# EAGLE design polarization_switch_mid (EAGLE 9.6.2)
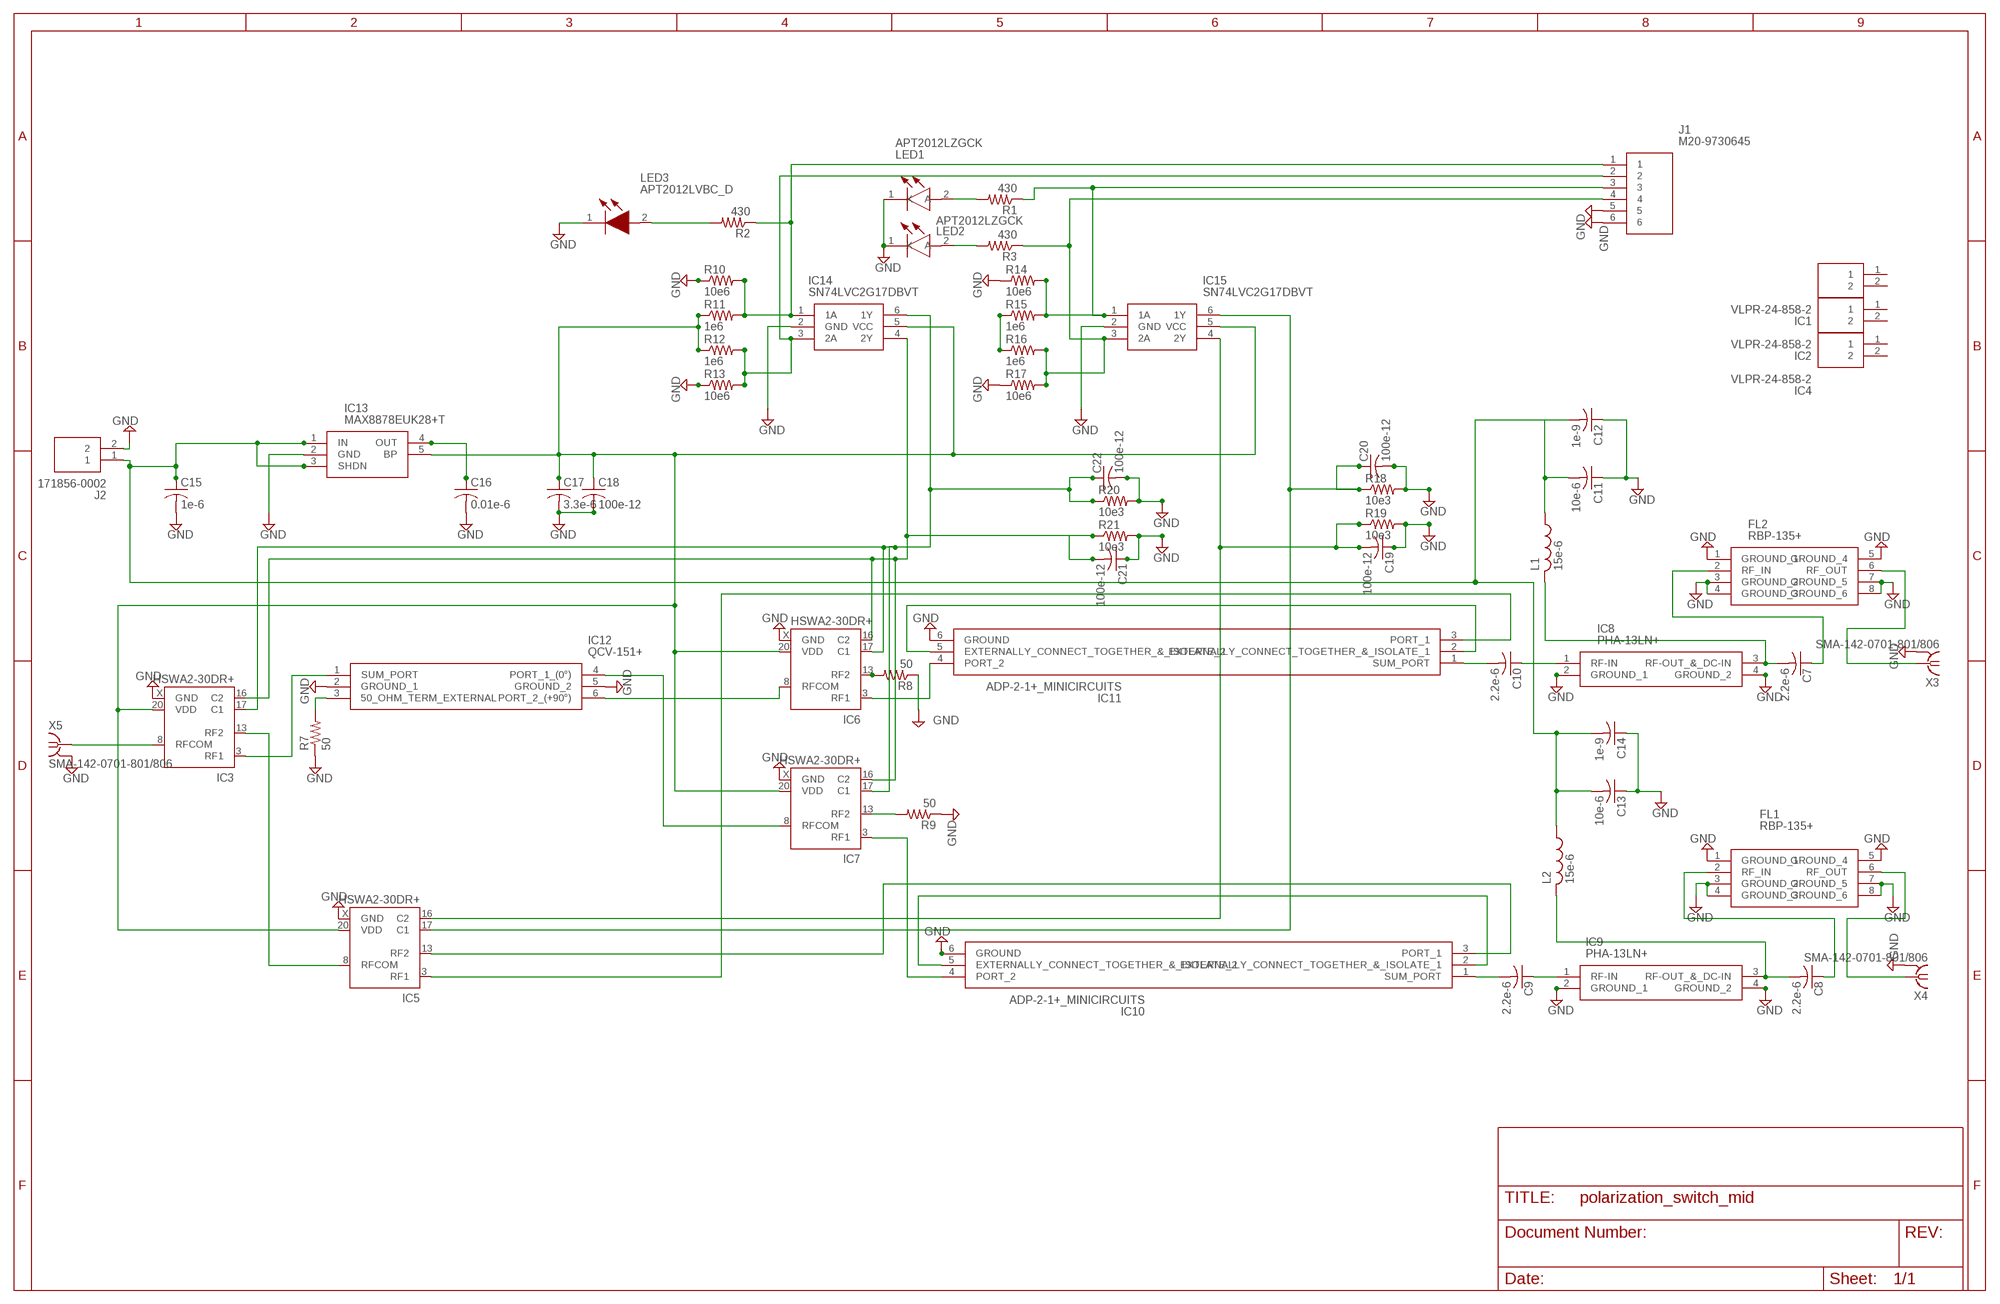
[diagram p0: schematic, sheet 1]

## Parts
C7  2.2e-6  C-USC0603  [C0603]
C8  2.2e-6  C-USC0603  [C0603]
C9  2.2e-6  C-USC0603  [C0603]
C10  2.2e-6  C-USC0603  [C0603]
C11  10e-6  C-USC0603  [C0603]
C12  1e-9  C-USC0603  [C0603]
C13  10e-6  C-USC0603  [C0603]
C14  1e-9  C-USC0603  [C0603]
C15  1e-6  C-USC0603  [C0603]
C16  0.01e-6  C-USC0603  [C0603]
C17  3.3e-6  C-USC0603  [C0603]
C18  100e-12  C-USC0603  [C0603]
C19  100e-12  C-USC0603  [C0603]
C20  100e-12  C-USC0603  [C0603]
C21  100e-12  C-USC0603  [C0603]
C22  100e-12  C-USC0603  [C0603]
FL1  RBP-135+  [RBP135]
FL2  RBP-135+  [RBP135]
IC1  VLPR-24-858-2  [VLPR248582]
IC2  VLPR-24-858-2  [VLPR248582]
IC3  HSWA2-30DR+  [DG983-1]
IC4  VLPR-24-858-2  [VLPR248582]
IC5  HSWA2-30DR+  [DG983-1]
IC6  HSWA2-30DR+  [DG983-1]
IC7  HSWA2-30DR+  [DG983-1]
IC8  PHA-13LN+  [PHA13LN]
IC9  PHA-13LN+  [PHA13LN]
IC10  ADP-2-1+_MINICIRCUITS  [SOTFL254P691X411-6N]
IC11  ADP-2-1+_MINICIRCUITS  [SOTFL254P691X411-6N]
IC12  QCV-151+  [QCV151]
IC13  MAX8878EUK28+T  [SOT95P280X145-5N]
IC14  SN74LVC2G17DBVT  [SOT95P280X145-6N]
IC15  SN74LVC2G17DBVT  [SOT95P280X145-6N]
J1  M20-9730645  [HDRV6W66P0X254_1X6_1524X254X96]
J2  171856-0002  [SHDR2W90P0X254_1X2_493X635X106]
L1  15e-6  L-USL3225M  [L3225M]
L2  15e-6  L-USL3225M  [L3225M]
LED1  APT2012LZGCK  [LEDC2012X85N]
LED2  APT2012LZGCK  [LEDC2012X85N]
LED3  APT2012LVBC_D  [LEDC2012X85N]
R1  430  R-US_R0603  [R0603]
R2  430  R-US_R0603  [R0603]
R3  430  R-US_R0603  [R0603]
R7  50  R-US_R0603  [R0603]
R8  50  R-US_R0603  [R0603]
R9  50  R-US_R0603  [R0603]
R10  10e6  R-US_R0603  [R0603]
R11  1e6  R-US_R0603  [R0603]
R12  1e6  R-US_R0603  [R0603]
R13  10e6  R-US_R0603  [R0603]
R14  10e6  R-US_R0603  [R0603]
R15  1e6  R-US_R0603  [R0603]
R16  1e6  R-US_R0603  [R0603]
R17  10e6  R-US_R0603  [R0603]
R18  10e3  R-US_R0603  [R0603]
R19  10e3  R-US_R0603  [R0603]
R20  10e3  R-US_R0603  [R0603]
R21  10e3  R-US_R0603  [R0603]
X3  SMA-142-0701-801/806  [J502-ND-142-0701-801/806]
X4  SMA-142-0701-801/806  [J502-ND-142-0701-801/806]
X5  SMA-142-0701-801/806  [J502-ND-142-0701-801/806]

## Nets
GND: C11.1 C12.1 C13.1 C14.1 C15.2 C16.2 C17.2 C18.2 C19.1 C20.2 C21.1 C22.2 FL1.1(GROUND_1) FL1.3(GROUND_2) FL1.4(GROUND_3) FL1.5(GROUND_4) FL1.7(GROUND_5) FL1.8(GROUND_6) FL2.1(GROUND_1) FL2.3(GROUND_2) FL2.4(GROUND_3) FL2.5(GROUND_4) FL2.7(GROUND_5) FL2.8(GROUND_6) IC3.X(GND) IC5.X(GND) IC6.X(GND) IC7.X(GND) IC8.2(GROUND_1) IC8.4(GROUND_2) IC9.2(GROUND_1) IC9.4(GROUND_2) IC10.6(GROUND) IC11.6(GROUND) IC12.2(GROUND_1) IC12.5(GROUND_2) IC13.2(GND) IC14.2(GND) IC15.2(GND) J1.5 J1.6 J2.2 LED1.1(K) LED2.1(K) LED3.1(K) R7.1 R8.1 R9.1 R10.1 R13.1 R14.1 R17.1 R18.2 R19.2 R20.2 R21.2 X3.G@1 X3.G@2 X3.G@3 X3.G@4 X4.G@1 X4.G@2 X4.G@3 X4.G@4 X5.G@1 X5.G@2 X5.G@3 X5.G@4
N$1: LED2.2(A) R3.2
N$2: LED1.2(A) R1.2
N$3: LED3.2(A) R2.2
N$4: IC5.13(RF2) IC10.3(PORT_1)
N$5: IC3.8(RFCOM) X5.1
N$6: C10.2 IC11.1(SUM_PORT)
N$7: IC7.3(RF1) IC10.4(PORT_2)
N$8: C20.1 IC5.17(C1) IC15.6(1Y) R18.1
N$9: IC7.8(RFCOM) IC12.4(PORT_1_(0°))
N$13: C10.1 IC8.1(RF-IN)
N$14: IC3.3(RF1) IC12.1(SUM_PORT)
N$15: IC3.13(RF2) IC5.8(RFCOM)
N$16: IC6.8(RFCOM) IC12.6(PORT_2_(+90°))
N$18: IC6.3(RF1) IC11.4(PORT_2)
N$19: IC6.13(RF2) R8.2
N$20: C7.2 IC8.3(RF-OUT_&_DC-IN) L1.2
N$21: C9.2 IC10.1(SUM_PORT)
N$22: IC11.2(EXTERNALLY_CONNECT_TOGETHER_&_ISOLATE_1) IC11.5(EXTERNALLY_CONNECT_TOGETHER_&_ISOLATE_2)
N$23: IC5.3(RF1) IC11.3(PORT_1)
N$25: IC10.2(EXTERNALLY_CONNECT_TOGETHER_&_ISOLATE_1) IC10.5(EXTERNALLY_CONNECT_TOGETHER_&_ISOLATE_2)
N$26: C9.1 IC9.1(RF-IN)
N$27: C8.2 IC9.3(RF-OUT_&_DC-IN) L2.2
N$28: C7.1 FL2.2(RF_IN)
N$29: FL2.6(RF_OUT) X3.1
N$30: C8.1 FL1.2(RF_IN)
N$31: FL1.6(RF_OUT) X4.1
N$32: IC12.3(50_OHM_TERM_EXTERNAL) R7.2
N$35: IC7.13(RF2) R9.2
N$36: C11.2 C12.2 C13.2 C14.2 C15.1 IC13.1(IN) IC13.3(SHDN) J2.1 L1.1 L2.1
N$37: IC14.1(1A) J1.1 R2.1 R10.2 R11.2
N$38: C19.2 IC5.16(C2) IC15.4(2Y) R19.1
N$39: C17.1 C18.1 IC3.20(VDD) IC5.20(VDD) IC6.20(VDD) IC7.20(VDD) IC13.5(BP) IC14.5(VCC) IC15.5(VCC) R11.1 R12.1
N$40: C16.1 IC13.4(OUT)
N$42: C22.1 IC3.17(C1) IC6.17(C1) IC7.17(C1) IC14.6(1Y) R20.1
N$43: IC14.3(2A) J1.2 R12.2 R13.2
N$44: IC15.1(1A) J1.3 R1.1 R14.2 R15.2
N$45: IC15.3(2A) J1.4 R3.1 R16.2 R17.2
N$46: C21.2 IC3.16(C2) IC6.16(C2) IC7.16(C2) IC14.4(2Y) R21.1
N$48: R15.1 R16.1
Unconnected: IC1.1 IC1.2 IC2.1 IC2.2 IC4.1 IC4.2

## Power pins joined to a net without a drawn wire
GND: IC3.1(GND) IC3.2(GND) IC3.4(GND) IC3.5(GND) IC3.6(GND) IC3.7(GND) IC3.9(GND) IC3.10(GND) IC3.11(GND) IC3.12(GND) IC3.14(GND) IC3.15(GND) IC3.18(GND) IC3.19(GND) IC5.1(GND) IC5.2(GND) IC5.4(GND) IC5.5(GND) IC5.6(GND) IC5.7(GND) IC5.9(GND) IC5.10(GND) IC5.11(GND) IC5.12(GND) IC5.14(GND) IC5.15(GND) IC5.18(GND) IC5.19(GND) IC6.1(GND) IC6.2(GND) IC6.4(GND) IC6.5(GND) IC6.6(GND) IC6.7(GND) IC6.9(GND) IC6.10(GND) IC6.11(GND) IC6.12(GND) IC6.14(GND) IC6.15(GND) IC6.18(GND) IC6.19(GND) IC7.1(GND) IC7.2(GND) IC7.4(GND) IC7.5(GND) IC7.6(GND) IC7.7(GND) IC7.9(GND) IC7.10(GND) IC7.11(GND) IC7.12(GND) IC7.14(GND) IC7.15(GND) IC7.18(GND) IC7.19(GND)

## Library data of the parts
C7-C22 = rcl:C-US: CAPACITOR, American symbol; SPICEPREFIX: C
FL1 FL2 = RBP-135+:RBP-135+: Metal Shield Bandpass Filter Source: Datasheet <https://www.minicircuits.com/pdfs/RBP-135 .pdf>; DESCRIPTION: Metal Shield Bandpass Filter; HEIGHT: 2.54mm; MANUFACTURER_NAME: Mini-Circuits; MANUFACTURER_PART_NUMBER: RBP-135+
IC1 IC2 IC4 = VLPR-24-858-2:VLPR-24-858-2: LED Light Pipes Light Pipe Vert SMD Rect Face Source: Datasheet <http://uk.rs-online.com/web/p/products/9063748>; DESCRIPTION: LED Light Pipes Light Pipe Vert SMD Rect Face; HEIGHT: 21mm; MANUFACTURER_NAME: Bivar; MANUFACTURER_PART_NUMBER: VLPR-24-858-2; RS_PART_NUMBER: 9063748; RS_PRICE-STOCK: http://uk.rs-online.com/web/p/products/9063748
IC3 IC5-IC7 = minicircuits:HSWA2-30DR+: SPDT RF SWITCH Absorptive RF Switch with internal driver Source: http://www.minicircuits.com .. HSWA2-30DR+.pdf; OC_FARNELL: unknown; OC_NEWARK: unknown
IC8 IC9 = PHA-13LN+:PHA-13LN+: ic Source: Datasheet <https://www.minicircuits.com/pdfs/PHA-13LN .pdf>; DESCRIPTION: ic; HEIGHT: 1.6mm; MANUFACTURER_NAME: Mini Circuits; MANUFACTURER_PART_NUMBER: PHA-13LN+
IC10 IC11 = ADP-2-1+_MINICIRCUITS:ADP-2-1+_MINICIRCUITS: Power Splitter/Combiner Source: Datasheet <https://www.minicircuits.com/pdfs/ADP-2-1 .pdf>; DESCRIPTION: Power Splitter/Combiner; HEIGHT: 4.11mm; MANUFACTURER_NAME: Mini-Circuits; MANUFACTURER_PART_NUMBER: ADP-2-1+ MINICIRCUITS
IC12 = QCV-151+:QCV-151+: 2 Way-90 Power Splitter Source: Datasheet <https://www.minicircuits.com/pdfs/QCV-151 .pdf>; DESCRIPTION: 2 Way-90 Power Splitter; HEIGHT: 1.652mm; MANUFACTURER_NAME: Mini-Circuits; MANUFACTURER_PART_NUMBER: QCV-151+
IC13 = MAX8878EUK28+T:MAX8878EUK28+T: LDO Voltage Regulators Low-Noise, Low-Dropout, 150mA Linear Regulators with 2982 Pinout Source: Datasheet <https://www.mouser.com/datasheet/2/256/MAX8878-1389229.pdf>; DESCRIPTION: LDO Voltage Regulators Low-Noise, Low-Dropout, 150mA Linear Regulators with 2982 Pinout; HEIGHT: 1.45mm; MANUFACTURER_NAME: Maxim Integrated; MANUFACTURER_PART_NUMBER: MAX8878EUK28+T
IC14 IC15 = SN74LVC2G17DBVT:SN74LVC2G17DBVT: DUAL SCHMITT-TRIGGER BUFFER Source: Datasheet <http://www.ti.com/lit/gpn/SN74LVC2G17>; DESCRIPTION: DUAL SCHMITT-TRIGGER BUFFER; HEIGHT: 1.45mm; MANUFACTURER_NAME: Texas Instruments; MANUFACTURER_PART_NUMBER: SN74LVC2G17DBVT; MOUSER_PART_NUMBER: 595-SN74LVC2G17DBVT; MOUSER_PRICE-STOCK: https://www.mouser.com/Search/Refine.aspx?Keyword=595-SN74LVC2G17DBVT; RS_PART_NUMBER: 6628944P; RS_PRICE-STOCK: http://uk.rs-online.com/web/p/products/6628944P
J1 = M20-9730645:M20-9730645: Headers & Wire Housings 06 SIL VERTICAL PIN HEADER GOLD HT Source: Datasheet <https://cdn.harwin.com/pdfs/C001XX_M20_Series_Connectors.pdf>; DESCRIPTION: Headers & Wire Housings 06 SIL VERTICAL PIN HEADER GOLD HT; HEIGHT: 9.64mm; MANUFACTURER_NAME: HARWIN; MANUFACTURER_PART_NUMBER: M20-9730645; MOUSER_PART_NUMBER: 855-M20-9730645; MOUSER_PRICE-STOCK: https://www.mouser.com/Search/Refine.aspx?Keyword=855-M20-9730645
J2 = 171856-0002:171856-0002: KK 254 RPC Pin Header friction lock 2way Molex KK 254 Series, Series Number 171856, 2.54mm Pitch 2 Way 1 Row Straight PCB Header, Through Hole Source: Datasheet <https://www.digikey.com/product-detail/en/molex/1718560002/WM10153-ND/4423109>; ALLIED_NUMBER: 70314268; ALLIED_PRICE-STOCK: https://www.alliedelec.com/molexincorporated-171856-0002/70314268/; DESCRIPTION: KK 254 RPC Pin Header friction lock 2way Molex KK 254 Series, Series Number 171856, 2.54mm Pitch 2 Way 1 Row Straight PCB Header, Through Hole; HEIGHT: 10.61mm; MANUFACTURER_NAME: Molex; MANUFACTURER_PART_NUMBER: 171856-0002; MOUSER_PART_NUMBER: 538-171856-0002; MOUSER_PRICE-STOCK: https://www.mouser.com/Search/Refine.aspx?Keyword=538-171856-0002; RS_PART_NUMBER: 7922884P; RS_PRICE-STOCK: http://uk.rs-online.com/web/p/products/7922884P
L1 L2 = rcl:L-US: INDUCTOR, American symbol; SPICEPREFIX: L
LED1 LED2 = APT2012LZGCK:APT2012LZGCK: Standard LEDs - SMD 2.0X1.2MM LOW CRNT Source: Datasheet <http://www.kingbrightusa.com/images/catalog/SPEC/APT2012LZGCK.pdf>; ALLIED_NUMBER: 71056205; ALLIED_PRICE-STOCK: https://www.alliedelec.com/kingbright-apt2012lzgck/71056205/; DESCRIPTION: Standard LEDs - SMD 2.0X1.2MM LOW CRNT; HEIGHT: 0.85mm; MANUFACTURER_NAME: Kingbright; MANUFACTURER_PART_NUMBER: APT2012LZGCK; MOUSER_PART_NUMBER: 604-APT2012LZGCK; MOUSER_PRICE-STOCK: https://www.mouser.com/Search/Refine.aspx?Keyword=604-APT2012LZGCK
LED3 = APT2012LVBC_D:APT2012LVBC_D: Standard LEDs - SMD 2.0X1.2MM LOW CRNT Source: Datasheet <https://componentsearchengine.com/Datasheets/1/APT2012LVBC_D.pdf>; ARROW_PART_NUMBER: APT2012LVBC/D; ARROW_PRICE-STOCK: https://www.arrow.com/en/products/apt2012lvbcd/kingbright; DESCRIPTION: Standard LEDs - SMD 2.0X1.2MM LOW CRNT; HEIGHT: 0.85mm; MANUFACTURER_NAME: Kingbright; MANUFACTURER_PART_NUMBER: APT2012LVBC/D; MOUSER_PART_NUMBER: 604-APT2012LVBCD; MOUSER_PRICE-STOCK: https://www.mouser.co.uk/ProductDetail/Kingbright/APT2012LVBC-D?qs=6oMev5NRZMGErJYT6KZLXg%3D%3D
R1-R3 R7-R21 = rcl:R-US_: RESISTOR, American symbol; SPICEPREFIX: R
X3-X5 = sma-flange_375mils:SMA-: SMA 50 Ohm End Launch Jack Receptacle - Round Contact Johnson Components Source: www.johnsoncomponents.com .. J502-ND.pdf; MF: JOHNSON COMPONENTS; MPN: 142-0701-801; OC_FARNELL: 1608592; OC_NEWARK: 90F2624

## Board
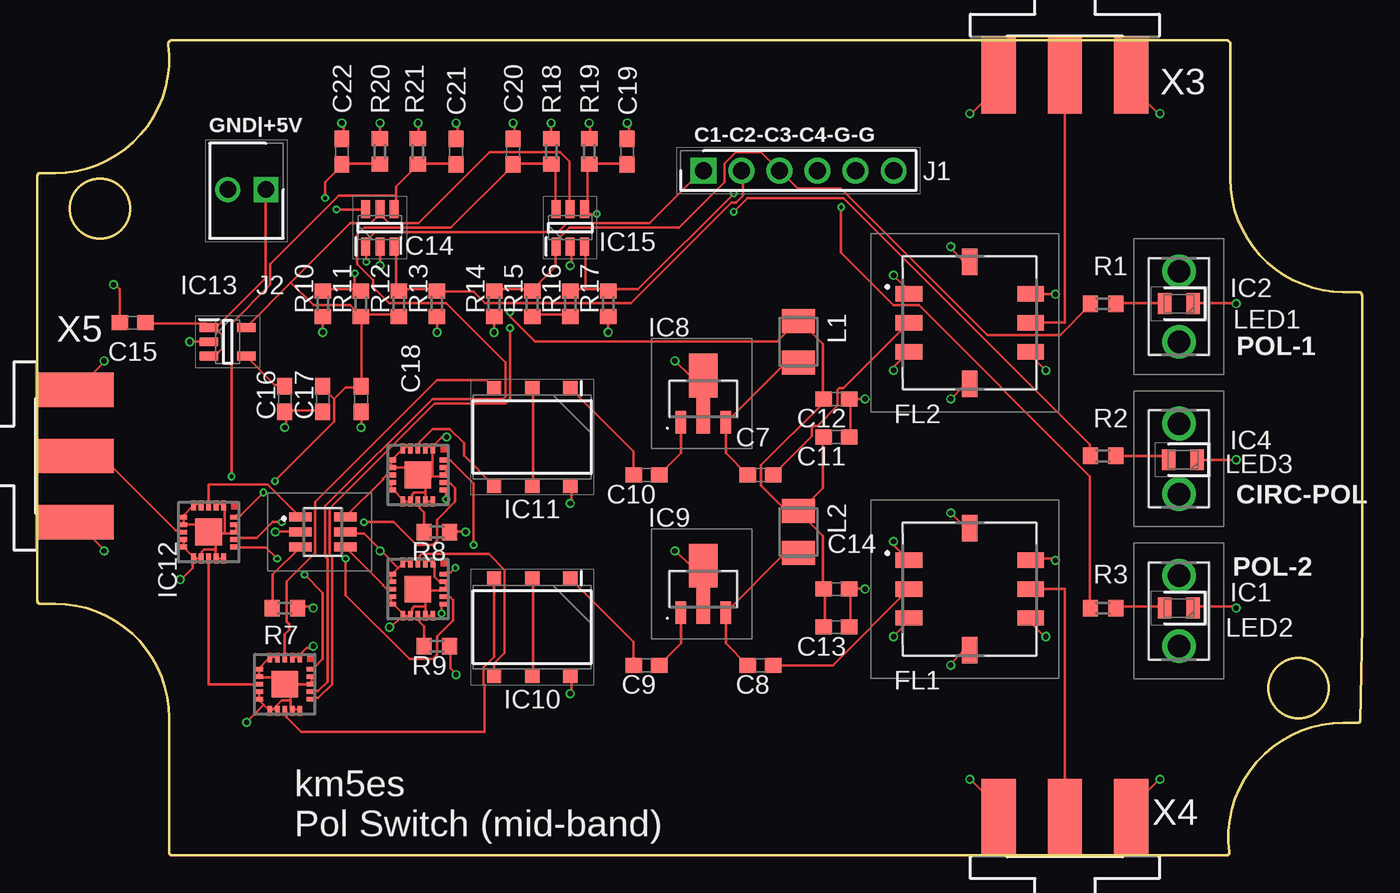
[diagram p1: board, top side]
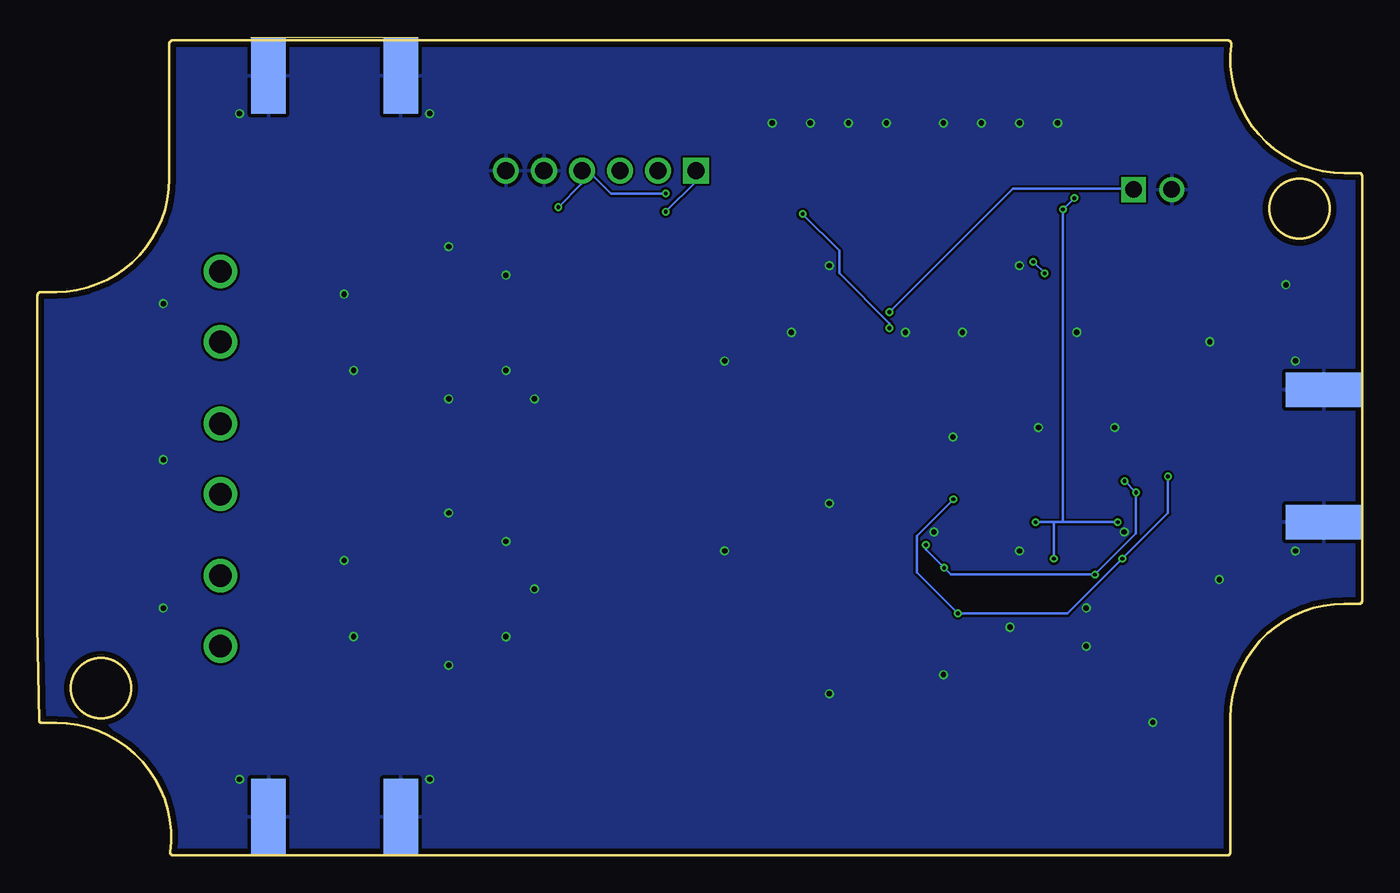
[diagram p2: board, bottom side, seen from below]

Size 88.42 x 54.42 mm. Coordinates in mm from the lower left corner, seen from the top.
Outline: 1.18,45.55 0.18,45.55 arc90 0,45.38 0,16.98 arc90 0.18,16.8 1.18,16.8 arc-90 8.8,9.18 8.8,0.18 arc90 8.98,0 79.38,0 arc97 79.55,0.2 arc-97 87.18,8.86 88.18,8.86 arc89 88.29,8.97 88.42,15.34 88.42,37.38 arc90 88.18,37.62 87.18,37.62 arc-90 79.62,45.18 79.62,54.18 arc90 79.38,54.42 8.98,54.42 arc99 8.74,54.14 arc-97 1.18,45.55
Outline: circle at 84.18,11.18 radius 2
Outline: circle at 4.18,43.18 radius 2
Copper layers (1*16): Top 0.035559375mm / dielectric 1.6mm / Bottom 0.035559375mm
Design rules "oshpark-2layer": minimum track width 6mil, minimum drill 10mil, track to track 6mil, track to pad 6mil, pad to pad 6mil, via to via 6mil, smd to smd 6mil, copper to edge 15mil, drill to drill 6mil, minimum pad ring 5mil, minimum via ring 5mil, stop-mask expansion 2.5mil, vias tented up to drill 0mil, thermal gap 10mil

### Footprints (pad centres in the part's own frame; a part is rotated, then mirrored left to right if it is on the bottom)
C0603 = smd 1.1 x 1: 1 -0.85,0; 2 0.85,0
RBP135 = smd 1.02 x 1.78: 1 -1.93,-4.065; 2 0,-4.065; 3 1.93,-4.065; 5 1.93,4.065; 6 0,4.065; 7 -1.93,4.065 | smd 1.78 x 1.02: 4 4.065,0; 8 -4.065,0
VLPR248582 = drill 1.5 pad 2.25: 1 0,0; 2 0,4.7
DG983-1 = smd 0.66 x 0.31: 1 -1.775,1; 2 -1.775,0.5; 3 -1.775,0; 4 -1.775,-0.5; 5 -1.775,-1; 11 1.775,-1; 12 1.775,-0.5; 13 1.775,0; 14 1.775,0.5; 15 1.775,1 | smd 0.31 x 0.66: 6 -1,-1.775; 7 -0.5,-1.775; 8 0,-1.775; 9 0.5,-1.775; 10 1,-1.775; 16 1,1.775; 17 0.5,1.775; 18 0,1.775; 19 -0.5,1.775; 20 -1,1.775 | smd 1.78 x 1.78: X 0,0
PHA13LN = smd 0.71 x 1.5: 1 -1.5,-1.56; 3 1.5,-1.56 | smd 0.91 x 2.5: 2 0,-1.06 | smd 1.91 x 2.92: 4 0,1.56
SOTFL254P691X411-6N = smd 0.935 x 0.96: 1 -3.262,2.54; 2 -3.262,0; 3 -3.262,-2.54; 4 3.262,-2.54; 5 3.262,0; 6 3.262,2.54
QCV151 = smd 0.6 x 1.5: 1 1,1.5; 2 0,1.5; 3 -1,1.5; 4 -1,-1.5; 5 0,-1.5; 6 1,-1.5
SOT95P280X145-5N = smd 1.25 x 0.6: 1 -1.25,0.95; 2 -1.25,0; 3 -1.25,-0.95; 4 1.25,-0.95; 5 1.25,0.95
SOT95P280X145-6N = smd 1.2 x 0.6: 1 -1.25,0.95; 2 -1.25,0; 3 -1.25,-0.95; 4 1.25,-0.95; 5 1.25,0; 6 1.25,0.95
HDRV6W66P0X254_1X6_1524X254X96 = drill 1.15 pad 1.725 square: 1 0,0 | drill 1.15 pad 1.725: 2 2.54,0; 3 5.08,0; 4 7.62,0; 5 10.16,0; 6 12.7,0
SHDR2W90P0X254_1X2_493X635X106 = drill 1.1 pad 1.65 square: 1 0,0 | drill 1.1 pad 1.65: 2 2.54,0
L3225M = smd 1.6 x 2.2: 1 -1.4,0; 2 1.4,0
LEDC2012X85N = smd 0.9 x 1.4: 1 -0.95,0; 2 0.95,0
R0603 = smd 1 x 1.1: 1 -0.85,0; 2 0.85,0
J502-ND-142-0701-801/806 = smd 5.08 x 2.286: 1 2.565,0; G@1 2.565,4.42; G@2 2.565,-4.42 | smd 5.08 x 2.286 bottom: G@3 2.565,4.42; G@4 2.565,-4.42

### Placement (x,y rotation side)
C7  48.26,25.4 180 top
C8  48.26,12.7 180 top
C9  40.64,12.7 180 top
C10  40.64,25.4 180 top
C11  53.34,27.94 180 top
C12  53.34,30.48 180 top
C13  53.34,15.24 180 top
C14  53.34,17.78 180 top
C15  6.35,35.56 180 top
C16  16.51,30.48 270 top
C17  19.05,30.48 270 top
C18  21.59,30.48 270 top
C19  39.37,46.99 270 top
C20  31.75,46.99 90 top
C21  27.94,46.99 270 top
C22  20.32,46.99 90 top
FL1  62.23,17.78 270 top
FL2  62.23,35.56 270 top
IC1  76.2,13.97 0 top
IC2  76.2,34.29 0 top
IC3  11.43,21.59 270 top
IC4  76.2,24.13 0 top
IC5  16.51,11.43 270 top
IC6  25.4,25.4 270 top
IC7  25.4,17.78 270 top
IC8  44.45,30.48 0 top
IC9  44.45,17.78 0 top
IC10  33.02,15.24 270 top
IC11  33.02,27.94 270 top
IC12  19.05,21.59 90 top
IC13  12.7,34.29 0 top
IC14  22.86,41.91 90 top
IC15  35.56,41.91 90 top
J1  44.45,45.72 0 top
J2  15.24,44.45 180 top
L1  50.8,34.29 270 top
L2  50.8,21.59 270 top
LED1  76.2,36.83 180 top
LED2  76.2,16.51 180 top
LED3  76.45,26.42 180 top
R1  71.12,36.83 0 top
R2  71.12,26.67 0 top
R3  71.12,16.51 0 top
R7  16.51,16.51 180 top
R8  26.67,21.59 180 top
R9  26.67,13.97 180 top
R10  19.05,36.83 90 top
R11  21.59,36.83 90 top
R12  24.13,36.83 90 top
R13  26.67,36.83 90 top
R14  30.48,36.83 90 top
R15  33.02,36.83 90 top
R16  35.56,36.83 90 top
R17  38.1,36.83 90 top
R18  34.29,46.99 90 top
R19  36.83,46.99 90 top
R20  22.86,46.99 90 top
R21  25.4,46.99 90 top
X3  68.58,54.61 270 top
X4  68.58,0 90 top
X5  0,26.67 0 top

### Tracks (layer width: path | path; a pad name or v marks a point on that pad's centre or on a via)
GND  (via drill 0.35)
  Top 0.152: IC8.2 44.5,29.57 44.5,32 IC8.4 44.35,32.16 43.43,32.16 42.67,32.92 v42.55,33.02 | IC9.2 44.5,16.76 44.5,19.2 IC9.4 44.35,19.36 43.59,19.36 42.67,20.27 v42.55,20.32 | IC6.4 24.84,27.28 24.54,27.28 IC6.5 24.38,27.13 23.77,26.52 IC6.6 23.62,26.36 IC6.7 23.77,25.91 24.84,25.91 25.3,25.45 IC6.X | IC6.9 23.62,24.84 23.62,24.54 IC6.10 23.77,24.38 24.38,23.77 IC6.11 24.54,23.62 24.84,23.62 IC6.12 24.99,23.77 24.99,24.08 25.15,24.23 25.91,24.23 | IC6.19 27.28,25.76 27.28,25.45 IC6.18 27.13,25.3 26.36,25.3 | IC6.15 26.36,23.62 IC6.14 25.91,23.77 25.91,24.23 | 25.91,24.84 25.91,24.23 | 25.91,24.84 25.45,25.3 IC6.X | 25.91,24.84 26.36,25.3 | 25.91,24.84 IC6.X | IC5.4 16,13.26 15.54,13.26 IC5.5 15.39,13.11 14.78,12.5 IC5.6 14.78,12.34 14.78,12.04 IC5.7 14.78,11.89 16,11.89 16.46,11.43 IC5.X | IC5.19 18.29,11.89 IC5.18 17.22,11.43 16.92,11.12 | IC5.15 17.37,9.75 17.07,9.75 IC5.14 16.92,9.75 16.92,10.36 | 16.92,11.12 16.92,10.36 | 16.92,11.12 16.61,11.43 IC5.X | 16.92,11.12 IC5.X | 9.75,22.1 9.75,22.55 IC3.6 9.75,22.71 10.36,23.32 IC3.5 10.52,23.47 10.82,23.47 IC3.4 | IC3.11 10.52,19.81 10.82,19.81 IC3.12 10.97,19.96 10.97,20.27 11.12,20.42 11.89,20.42 | IC3.9 9.75,21.03 9.75,20.73 IC3.10 9.75,20.57 10.36,19.96 IC3.11 | IC3.2 12.04,23.47 12.34,23.47 IC3.1 12.5,23.32 12.5,21.49 | IC3.19 13.26,21.95 13.26,21.64 IC3.18 13.11,21.49 12.5,21.49 | IC3.15 12.34,19.81 12.04,19.81 IC3.14 11.89,19.96 11.89,20.42 | 11.89,21.03 11.89,20.42 | 11.89,21.03 11.43,21.49 IC3.X | 12.5,21.49 12.34,21.49 11.89,21.03 | 11.89,21.03 IC3.X | 9.75,22.1 10.97,22.1 11.43,21.64 IC3.X | 9.75,22.1 IC3.7
  Top 0.152: IC7.2 25.91,19.66 26.36,19.66 IC7.1 26.52,19.51 26.52,18.59 26.82,18.29 27.13,18.29 IC7.19 27.28,18.14 27.28,17.83 IC7.18 27.13,17.68 26.36,17.68 25.91,17.22 | IC7.15 26.36,16 IC7.14 25.91,16.15 25.91,16.61 | 25.91,17.22 25.91,16.61 | 25.91,17.22 25.45,17.68 IC7.X 25.91,17.22 | 54.25,30.48 54.25,28.04 C11.1 | C13.1 54.25,15.24 54.25,17.68 C14.1 54.25,17.83 55.17,17.83 v55.24,17.78 | IC7.7 23.62,18.75 IC7.6 23.77,18.9 24.08,19.2 | IC7.4 24.84,19.66 24.54,19.66 IC7.5 24.38,19.51 24.08,19.2 | IC7.9 23.62,17.22 23.62,16.92 IC7.10 23.77,16.76 24.38,16.15 IC7.11 | IC7.11 24.54,16 24.84,16 IC7.12 24.99,16.15 24.99,16.46 25.15,16.61 25.91,16.61 | IC5.9 14.78,10.82 14.78,10.52 IC5.10 14.78,10.36 15.09,10.06 | 15.7,9.75 16,9.75 IC5.12 | 15.7,9.75 15.54,9.75 IC5.11 15.39,9.75 15.09,10.06 | IC6.2 25.91,27.28 26.36,27.28 IC6.1 | IC5.2 17.07,13.26 17.37,13.26 IC5.1 17.53,13.26 17.53,13.41 17.98,13.87 18.29,13.87 v18.41,13.97 | IC6.1 26.52,27.28 26.52,27.43 26.98,27.89 27.28,27.89 v27.3,27.94 | IC10.6 35.66,11.89 35.66,10.82 v35.56,10.79 | IC11.6 35.66,24.54 35.66,23.62 v35.56,23.5 | R9.1 27.58,13.87 27.58,12.5 27.89,12.19 v27.94,12.06 | C15.2 5.49,35.66 5.49,37.8 5.18,38.1 v5.08,38.1 | v16.51,28.57 16.61,28.65 16.61,29.57 C16.2 16.61,29.72 19.05,29.72 C17.2 | R7.1 17.37,16.61 18.29,16.61 v18.41,16.51 | C18.2 21.64,29.57 21.64,28.65 v21.59,28.57 | v19.05,34.92 R10.1 | C22.2 20.42,47.85 20.42,48.77 v20.32,48.9 | v22.86,48.9 R20.2 | R21.2 25.45,47.85 25.45,48.77 v25.4,48.9 | v26.67,34.92 R13.1 | R8.1 27.58,21.64 28.5,21.64 v28.57,21.59 | C21.1 28.04,47.85 28.04,48.77 v27.94,48.9
  Top 0.152: v30.48,34.92 R14.1 | v38.1,34.92 R17.1 | C20.2 31.85,47.85 31.85,48.77 v31.75,48.9 | v34.29,48.9 R18.2 | R19.2 36.88,47.85 36.88,48.77 v36.83,48.9 | C19.1 39.47,47.85 39.47,48.77 v39.37,48.9 | v22.86,39.37 IC14.2 | IC15.2 35.66,40.54 35.66,39.47 v35.56,39.37 | v10.16,34.29 IC13.2 | LED2.1 77.27,16.61 80.01,16.61 v80.01,16.51 | LED1.1 77.27,36.88 80.01,36.88 v80.01,36.83 | IC12.2 17.53,21.64 16,21.64 v15.88,21.59 | 22.86,20.42 21.79,21.49 20.57,21.49 IC12.5 | 15.09,10.06 14.02,8.99 v13.97,8.89 | IC7.11 24.38,16 23.62,15.24 v23.5,15.24 | 22.86,20.42 24.08,19.2 | 22.86,20.42 v22.86,20.32 | FL1.3 58.06,15.85 58.06,15.54 57.15,14.63 v57.15,14.61 | FL1.4 62.18,13.56 61.72,13.56 60.96,12.8 v60.96,12.7 | v57.15,20.95 57.15,20.73 58.06,19.81 FL1.1 | v60.96,22.86 61.87,21.95 62.18,21.95 FL1.8 | FL1.5 66.45,15.85 66.45,15.39 67.21,14.63 v67.31,14.61 | FL1.7 66.45,19.81 67.82,19.81 v67.94,19.68 | v57.15,32.38 57.15,32.61 58.06,33.53 FL2.3 | FL2.1 58.06,37.49 58.06,37.8 57.15,38.71 v57.15,38.73 | v60.96,30.48 61.87,31.39 62.18,31.39 FL2.4 | FL2.8 62.18,39.78 61.72,39.78 60.96,40.54 v60.96,40.64 | FL2.5 66.45,33.53 66.45,33.22 67.21,32.46 v67.31,32.38 | FL2.7 66.45,37.49 67.82,37.49 v67.94,37.47 | v55.24,30.48 54.25,30.48 | 54.25,30.48 C12.1 | IC3.11 10.36,19.81 10.36,19.2 9.6,18.44 v9.53,18.41 | 16.92,10.36 16.31,10.36 15.7,9.75 | 26.36,25.3 26.36,27.13 IC6.1 | X5.G@4 2.59,22.25 4.42,20.42 v4.45,20.32 | X5.G@1 2.59,31.09 4.42,32.92 v4.45,33.02 | X4.G@1 64.16,3.2 62.33,5.03 v62.23,5.08 | X4.G@4 73,3.2 74.83,5.03 v74.93,5.08 | X3.G@4 64.16,51.36 62.33,49.53 v62.23,49.53 | X3.G@1 73,51.36 74.83,49.53 v74.93,49.53
  Top 0.152: LED3.1 v80.01,26.42
  pour Bottom: 0,16.51 8.89,7.62 8.89,0 80.01,0 81.28,1.27 81.28,6.35 83.82,8.89 88.9,8.89 88.9,38.1 85.09,38.1 80.01,43.18 80.01,54.61 8.89,54.61 7.62,53.34 5.08,50.8 5.08,46.99 3.81,45.72 0,45.72
N$1
  Top 0.152: R3.2 72.08,16.61 75.13,16.61 LED2.2
N$2
  Top 0.152: R1.2 72.08,36.88 75.13,36.88 LED1.2
N$3
  Top 0.152: R2.2 75.25,26.67 LED3.2
N$4
  Top 0.152: IC5.13 16.63,9.54 16.63,9.23 17.6,8.26 29.84,8.26 29.84,11.34 29.77,11.42 29.77,12.54 30.48,13.25 IC10.3
N$5
  Top 0.152: IC3.8 9.54,21.71 9.23,21.71 4.27,26.67 X5.1
N$6
  Top 0.152: IC11.1 39.79,26.97 C10.2
N$7
  Top 0.152: IC10.4 30.48,12.82 31.19,13.53 31.19,19.06 30.14,20.11 25.65,20.11 25.52,19.98 25.52,19.67 IC7.3
N$8
  Top 0.152: IC5.17 18.29,10.97 18.75,10.97 19.36,11.58 19.36,19.81 19.2,19.96 19.2,23.32 26.36,30.48 31.09,30.48 31.24,30.63 31.24,32.92 27.28,36.88 23.47,36.88 22.4,37.95 22.4,38.41 21.34,39.47 21.34,41.45 21.79,41.91 27.58,41.91 31.7,46.02 C20.1 31.85,46.18 34.29,46.18 R18.1 34.29,46.02 34.59,45.72 34.59,43.28 IC15.6
N$9
  Top 0.152: IC12.4 23.07,18.07 23.07,18.03 23.32,17.78 IC7.8
N$13
  Top 0.152: C10.1 42.95,26.86 IC8.1
N$14
  Top 0.152: IC3.3 11.43,24.77 15.38,24.77 IC12.1
N$15
  Top 0.152: IC3.13 11.43,11.43 IC5.8
N$16
  Top 0.152: IC12.6 23.07,25.11 23.07,25.15 23.32,25.4 IC6.8
N$18
  Top 0.152: IC6.3 25.52,27.29 25.52,27.6 26.39,28.47 27.52,28.47 28.47,27.52 28.47,26.69 IC11.4
N$19
  Top 0.152: IC6.13 25.52,23.51 25.52,23.2 25.82,22.9 R8.2
N$20
  Top 0.152: C7.2 45.95,26.86 IC8.3 46.02,28.96 49.84,32.77 50.75,32.77 L1.2
N$21
  Top 0.152: IC10.1 39.79,14.27 C9.2
N$22
  Top 0.152: IC11.5 33.07,24.69 33.07,31.09 IC11.2
N$23
  Top 0.152: IC5.3 16.51,14.76 16.79,15.04 16.79,15.44 16.63,15.6 16.63,18.3 18.53,20.2 18.53,23.61 26.67,31.75 29.93,31.75 IC11.3
N$25
  Top 0.152: IC10.5 33.07,12.04 33.07,18.44 IC10.2
N$26
  Top 0.152: C9.1 42.95,14.16 IC9.1
N$27
  Top 0.152: C8.2 45.95,14.16 IC9.3 46.02,16.31 49.84,20.12 50.75,20.12 L2.2
N$28
  Top 0.152: C7.1 51.71,28 51.71,28.54 51.84,28.67 52.05,28.67 53.41,30.03 53.41,31.07 53.55,31.21 53.81,31.21 FL2.2
N$29
  Top 0.152: FL2.6 68.58,35.56 X3.1
N$30
  Top 0.152: C8.1 53.09,12.7 FL1.2
N$31
  Top 0.152: FL1.6 68.58,17.78 X4.1
N$32
  Top 0.152: R7.2 15.7,16.61 15.7,18.75 17.53,20.57 IC12.3
N$35
  Top 0.152: IC7.13 25.52,15.89 25.52,15.58 25.82,15.28 R9.2
N$36  (via drill 0.25)
  Top 0.152: C15.1 7.32,35.51 11.28,35.51 11.43,35.36 IC13.1 | 11.89,35.2 12.34,34.75 12.34,33.83 11.89,33.38 11.58,33.38 IC13.3 | 11.89,35.2 11.58,35.2 IC13.1 | J2.1 15.24,38.56 11.89,35.2 | 11.89,35.2 IC13.1 | 52.43,30.48 52.43,34.14 50.9,35.66 L1.1 50.75,35.66 49.38,34.29 33.22,34.29 31.55,35.97 v31.55,36.27 | C13.2 52.58,15.24 52.58,17.68 C14.2 52.43,17.83 52.43,21.34 50.9,22.86 L2.1 | C11.2 52.43,27.89 52.43,24.54 50.9,23.01 L2.1 | 52.43,30.48 52.43,30.18 48.31,26.06 48.31,24.69 49.99,23.01 50.75,23.01 L2.1 | 52.43,30.48 C12.2
  Bottom 0.152: v31.55,36.27 23.32,44.5 15.24,44.5 J2.1
N$37  (via drill 0.25)
  Top 0.152: 21.18,37.8 21.49,37.8 R11.2 21.18,37.8 | 21.18,37.8 19.05,37.8 R10.2 | v46.48,42.98 47.4,43.89 53.8,43.89 70.26,27.43 70.26,26.67 R2.1 | J1.1 44.35,45.72 40.84,42.22 35.36,42.22 34.75,41.6 22.55,41.6 21.95,41 21.95,40.69 IC14.1 21.95,40.54 v21.95,39.62 | v21.18,38.86 21.18,37.8
  Bottom 0.152: v46.48,42.98 44.5,44.96 44.5,45.72 J1.1 | v21.95,39.62 v21.18,38.86
N$38  (via drill 0.25)
  Top 0.152: C19.2 39.32,46.18 36.88,46.18 R19.1 36.73,46.02 36.73,43.43 36.58,43.28 IC15.4 36.58,43.13 36.88,42.82 v37.34,42.82 | v31.55,35.2 31.55,30.48 31.24,30.18 26.52,30.18 19.51,23.16 19.51,20.12 19.66,19.96 19.66,11.43 18.75,10.52 18.29,10.52 IC5.16
  Bottom 0.152: v31.55,35.2 31.55,35.51 34.9,38.86 34.9,40.39 v37.34,42.82
N$39  (via drill 0.25)
  Top 0.152: 22.86,42.82 IC14.5 | 22.86,42.82 22.25,42.22 20.88,42.22 16.92,38.25 | 16.92,38.25 14.02,35.36 IC13.5 | 22.86,42.82 23.47,42.22 25.45,42.22 30.18,46.94 34.9,46.94 35.51,46.33 35.51,43.28 IC15.5 | R11.1 21.64,36.12 24.08,36.12 R12.1 | v15.09,24.23 13.56,22.71 13.26,22.71 IC3.20 | v15.85,24.99 19.81,28.96 19.81,30.48 | 19.81,30.48 19.05,31.24 C17.1 | v17.83,18.75 19.05,17.53 19.05,13.11 18.44,12.5 18.29,12.5 IC5.20 | v27.89,19.2 27.58,18.9 27.28,18.9 IC7.20 | v29.11,20.73 29.11,24.84 27.58,26.36 27.28,26.36 IC6.20 | 19.81,30.48 20.57,31.24 21.49,31.24 C18.1 21.64,31.39 21.64,35.97 R11.1 | 16.92,38.25 18.44,36.73 20.88,36.73 21.49,36.12 R11.1
  Bottom 0.152: v15.85,24.99 v15.09,24.23 15.09,21.49 v17.83,18.75 27.43,18.75 v27.89,19.2 29.11,20.42 v29.11,20.73
N$40
  Top 0.152: C16.1 16.46,31.39 15.85,31.39 14.02,33.22 IC13.4
N$42  (via drill 0.25)
  Top 0.152: R20.1 22.86,46.18 20.42,46.18 C22.1 20.27,46.02 19.2,44.96 v19.2,43.89 | v19.96,43.13 21.79,43.13 IC14.6 | v16.31,22.25 15.7,22.25 14.63,21.18 13.26,21.18 IC3.17 | v21.79,22.25 23.77,22.25 25.3,20.73 26.36,20.73 26.67,21.03 26.67,22.4 27.89,23.62 27.89,24.54 27.58,24.84 27.28,24.84 IC6.17 | v20.57,19.81 20.57,17.37 24.84,13.11 26.36,13.11 26.67,13.41 26.67,14.63 27.74,15.7 27.74,17.07 27.58,17.22 27.28,17.22 IC7.17
  Bottom 0.152: v19.2,43.89 v19.96,43.13 19.96,22.25 | v21.79,22.25 20.57,22.25 | 20.57,22.25 19.96,22.25 | 19.96,22.25 v16.31,22.25 | 20.57,22.25 v20.57,19.81
N$43
  Top 0.152: IC14.3 23.93,40.54 23.93,37.95 24.08,37.8 R12.2 24.23,37.8 26.67,37.8 R13.2 26.67,37.64 29.11,37.64 29.87,36.88 39.62,36.88 46.33,43.59 46.63,43.59 47.09,44.04 47.09,45.72 J1.2
N$44
  Top 0.152: R14.2 30.48,37.8 32.92,37.8 R15.2 33.07,37.8 34.59,39.32 34.59,40.54 IC15.1 34.75,40.69 34.75,41.15 35.51,41.91 42.82,41.91 45.87,44.96 45.87,46.18 46.63,46.94 48.31,46.94 J1.3 50.75,44.5 53.65,44.5 63.4,34.75 68.28,34.75 70.26,36.73 R1.1
N$45  (via drill 0.25)
  Top 0.152: 38.1,37.8 36.58,37.8 | 36.58,37.8 35.66,37.8 R16.2 | 36.58,37.8 36.58,40.54 IC15.3 | v53.65,43.28 53.65,40.23 57.15,36.73 58.83,36.73 70.26,25.3 70.26,16.61 R3.1 | 38.1,37.8 40.08,37.8 v46.48,44.2 | 38.1,37.8 R17.2
  Bottom 0.152: v53.65,43.28 52.12,44.81 52.12,45.72 J1.4 51.66,45.72 50.14,44.2 v46.48,44.2
N$46  (via drill 0.25)
  Top 0.152: C21.2 27.89,46.18 25.45,46.18 R21.1 25.3,46.02 23.93,44.65 23.93,44.04 | 23.93,44.04 23.93,43.28 IC14.4 | v16,19.81 15.24,20.57 13.26,20.57 IC3.16 | v26.98,16.15 26.98,16.61 27.13,16.76 IC7.16 | v27.28,23.77 27.28,24.38 IC6.16 | 23.93,44.04 20.12,44.04 15.54,39.47 15.54,38.1 12.95,35.51 v12.95,25.3
  Bottom 0.152: v27.28,23.77 29.72,21.34 29.72,18.9 v26.98,16.15 19.66,16.15 v16,19.81 12.95,22.86 v12.95,25.3
N$48
  Top 0.152: R15.1 33.07,36.12 35.51,36.12 R16.1

### Text on the board
tNames: GND|+5V | C1-C2-C3-C4-G-G | POL-1 | CIRC-POL | POL-2 | km5es / Pol Switch (mid-band)